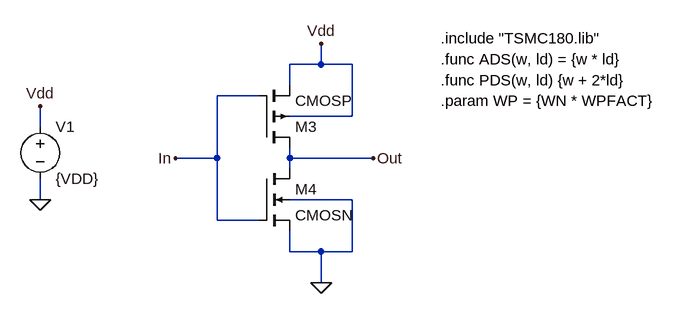
[diagram p0: schematic inversor.asc]
inversor.asc, the LTspice schematic file:
Version 4
SHEET 1 1392 680
WIRE 784 80 784 48
WIRE 784 80 736 80
WIRE 832 80 784 80
WIRE 736 112 736 80
WIRE 688 128 624 128
WIRE 832 160 832 80
WIRE 832 160 736 160
WIRE 352 176 352 144
WIRE 624 224 624 128
WIRE 624 224 560 224
WIRE 736 224 736 208
WIRE 864 224 736 224
WIRE 736 240 736 224
WIRE 352 288 352 256
WIRE 832 288 736 288
WIRE 624 320 624 224
WIRE 688 320 624 320
WIRE 736 368 736 336
WIRE 784 368 736 368
WIRE 832 368 832 288
WIRE 832 368 784 368
WIRE 784 416 784 368
FLAG 784 48 Vdd
FLAG 864 224 Out
FLAG 560 224 In
FLAG 784 416 0
FLAG 352 288 0
FLAG 352 144 Vdd
SYMBOL pmos4 688 208 M180
SYMATTR InstName M3
SYMATTR Value CMOSP
SYMATTR Value2 l={L} w={WP} ad={ADS(WP, LD)} as={ADS(WP, LD)} pd={PDS(WP, LD)} ps={PDS(WP, LD)}
SYMBOL nmos4 688 240 R0
SYMATTR InstName M4
SYMATTR Value CMOSN
SYMATTR Value2 l={L} w={WN} ad={ADS(WN, LD)} as={ADS(WN, LD)} pd={PDS(WN, LD)} ps={PDS(WN, LD)}
SYMBOL voltage 352 160 R0
WINDOW 123 0 0 Left 0
WINDOW 39 0 0 Left 0
SYMATTR InstName V1
SYMATTR Value {VDD}
TEXT 968 40 Left 2 !.include "TSMC180.lib"
TEXT 968 72 Left 2 !.func ADS(w, ld) = {w * ld}
TEXT 968 104 Left 2 !.func PDS(w, ld) {w + 2*ld}
TEXT 968 136 Left 2 !.param WP = {WN * WPFACT}

The netlist it stands for:
* inversor.asc
M3 Out In Vdd Vdd CMOSP l={L} w={WP} ad={ADS(WP, LD)} as={ADS(WP, LD)} pd={PDS(WP, LD)} ps={PDS(WP, LD)}
M4 Out In 0 0 CMOSN l={L} w={WN} ad={ADS(WN, LD)} as={ADS(WN, LD)} pd={PDS(WN, LD)} ps={PDS(WN, LD)}
V1 Vdd 0 {VDD}
.model NMOS NMOS
.model PMOS PMOS
.lib standard.mos
.include "TSMC180.lib"
.func ADS(w, ld) = {w * ld}
.func PDS(w, ld) {w + 2*ld}
.param WP = {WN * WPFACT}
.backanno
.end